# EAGLE schematic elektrikal-skematik (EAGLE 9.6.2)
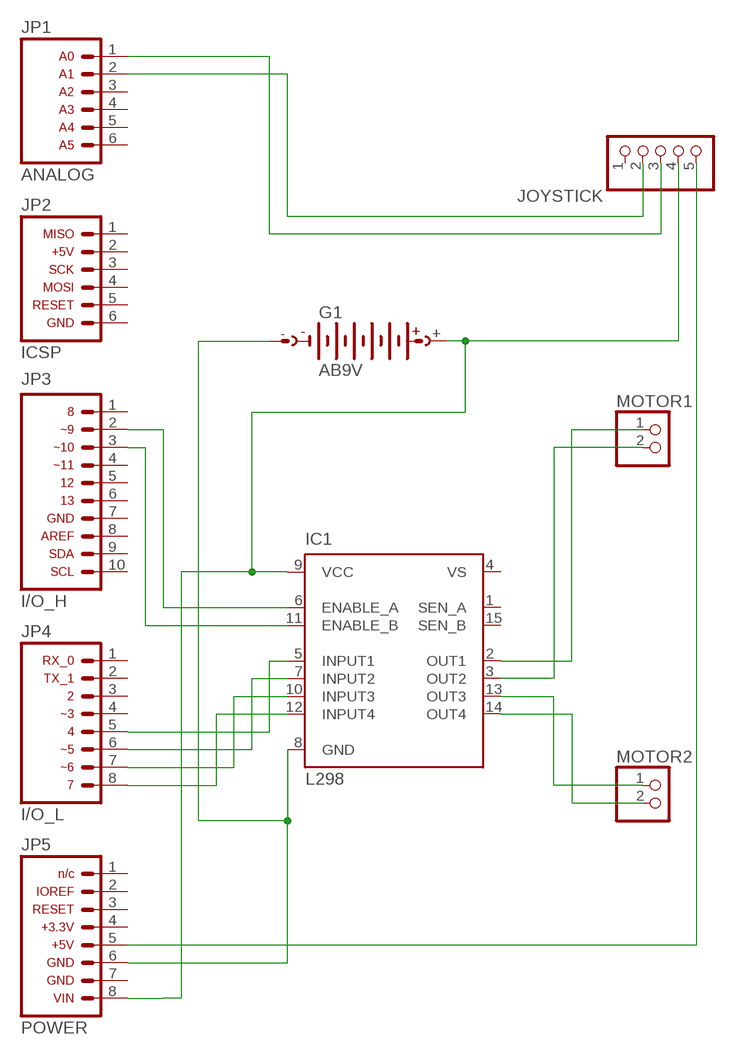
[diagram p0: schematic, sheet 1]

## Parts
G1  AB9V  [AB9V]
IC1  L298  [MULTIWATT-15]
JOYSTICK  PINHD-1X55X2MM  [1_05X2MM]
JP1  ARDUINO_CONN-ANALOGSIP  [CONN-1X06]
JP2  ARDUINO_CONN-ICSP  [CONN-2X03]
JP3  ARDUINO_CONN-IO_HSIP  [CONN-1X10]
JP4  ARDUINO_CONN-IO_LSIP  [CONN-1X08]
JP5  ARDUINO_CONN-POWERSIP  [CONN-1X08]
MOTOR1  PINHD-1X2  [1X02]
MOTOR2  PINHD-1X2  [1X02]

## Nets
N$1: IC1.5(INPUT1) JP4.5
N$2: IC1.7(INPUT2) JP4.6
N$3: IC1.10(INPUT3) JP4.7
N$4: IC1.12(INPUT4) JP4.8
N$5: IC1.6(ENABLE_A) JP3.2
N$6: IC1.11(ENABLE_B) JP3.3
N$7: G1.- IC1.8(GND) JP5.6
N$8: G1.+ IC1.9(VCC) JOYSTICK.4
N$9: JOYSTICK.3 JP1.1
N$10: JOYSTICK.2 JP1.2
N$11: IC1.2(OUT1) MOTOR1.1
N$12: IC1.3(OUT2) MOTOR1.2
N$13: IC1.13(OUT3) MOTOR2.1
N$14: JOYSTICK.5 JP5.5
N$15: IC1.14(OUT4) MOTOR2.2
N$16: JP5.8
Unconnected: IC1.1(SEN_A) IC1.15(SEN_B) JOYSTICK.1 JP1.3 JP1.4 JP1.5 JP1.6 JP2.1 JP2.2 JP2.3 JP2.4 JP2.5 JP2.6 JP3.1 JP3.4 JP3.5 JP3.6 JP3.7 JP3.8 JP3.9 JP3.10 JP4.1 JP4.2 JP4.3 JP4.4 JP5.1 JP5.2 JP5.3 JP5.4 JP5.7

## Power pins joined to a net without a drawn wire
VS: IC1.4(VS)

## Library data of the parts
G1 = battery:AB9V: 9-V BATTERY CLIP
IC1 = st-microelectronics:L298: DUAL FULL-BRIDGE DRIVER; MPN: L298N; OC_FARNELL: 1589425; OC_NEWARK: 32M1527
JOYSTICK = pinhead:PINHD-1X5: PIN HEADER
JP1 = arduino_jw:ARDUINO_CONN-ANALOG: Arduino Analog I/O Header This is the analog I/O header on the Arduino Uno R3. This connector is labeled with the following pin assignments: Analog 0 Analog 1 Analog 2 Analog 3 Analog 4 Analog 5 NOTE: Be sure you install this connector with the correct orientation on your PCB layout. Pin 1 has a square pad to assist with orientation.
JP2 = arduino_jw:ARDUINO_CONN-ICSP: Arduino ICSP I/O Header This is the ICSP I/O header on the Arduino Uno R3. This connector is labeled with the following pin assignments: MISO +5V SCK MOSI RESET GND NOTE: Be sure you install this connector with the correct orientation on your PCB layout. Pin 1 has a square pad to assist with orientation.
JP3 = arduino_jw:ARDUINO_CONN-IO_H: Arduino Digital I/O [High Byte] Header This is the Digital I/O [high byte] header on the Arduino Uno R3. This connector is labeled with the following pin assignments: Digital 8 Digital 9 [PWM] Digital 10 [PWM] Digital 11 [PWM] Digital 12 Digital 13 GND AREF SDA SCL NOTE: Be sure you install this connector with the correct orientation on your PCB layout. Pin 1 has a square pad to assist with orientation.
JP4 = arduino_jw:ARDUINO_CONN-IO_L: Arduino Digital I/O [Low Byte] Header This is the Digital I/O [low byte] header on the Arduino Uno R3. This connector is labeled with the following pin assignments: Digital 0, Serial Rx Digital 1, Serial Tx Digital 2 Digital 4 Digital 5 [PWM] Digital 6 [PWM] Digital 7 NOTE: Be sure you install this connector with the correct orientation on your PCB layout. Pin 1 has a square pad to assist with orientation.
JP5 = arduino_jw:ARDUINO_CONN-POWER: Arduino Power Header This is the power header on the Arduino Uno R3. This connector is labeled with the following pin assignments: n/c IO Ref RESET +3.3V +5V GND GND VIN NOTE: Be sure you install this connector with the correct orientation on your PCB layout. Pin 1 has a square pad to assist with orientation.
MOTOR1 = pinhead:PINHD-1X2: PIN HEADER; POLARITY1: +
MOTOR2 = pinhead:PINHD-1X2: PIN HEADER